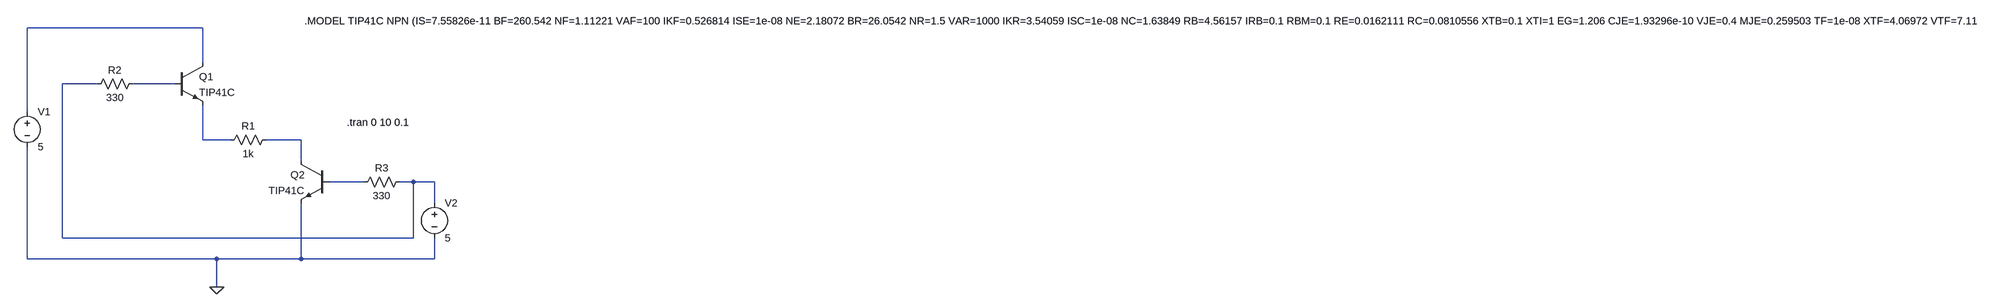
[diagram p0: schematic Draft14.asc]
Draft14.asc, the LTspice schematic file:
Version 4
SHEET 1 6028 688
WIRE 368 80 -32 80
WIRE 368 160 368 80
WIRE 128 208 48 208
WIRE 304 208 208 208
WIRE -32 272 -32 80
WIRE 368 336 368 256
WIRE 432 336 368 336
WIRE 592 336 512 336
WIRE 592 384 592 336
WIRE 736 432 656 432
WIRE 848 432 816 432
WIRE 896 432 848 432
WIRE 896 480 896 432
WIRE 48 560 48 208
WIRE 848 560 848 432
WIRE 848 560 48 560
WIRE -32 608 -32 352
WIRE 400 608 -32 608
WIRE 592 608 592 480
WIRE 592 608 400 608
WIRE 896 608 896 560
WIRE 896 608 592 608
WIRE 400 672 400 608
FLAG 400 672 0
SYMBOL npn 304 160 R0
SYMATTR InstName Q1
SYMATTR Value TIP41C
SYMBOL npn 656 384 M0
SYMATTR InstName Q2
SYMATTR Value TIP41C
SYMBOL res 528 320 R90
WINDOW 0 0 56 VBottom 2
WINDOW 3 32 56 VTop 2
SYMATTR InstName R1
SYMATTR Value 1k
SYMBOL res 224 192 R90
WINDOW 0 0 56 VBottom 2
WINDOW 3 32 56 VTop 2
SYMATTR InstName R2
SYMATTR Value 330
SYMBOL res 832 416 R90
WINDOW 0 0 56 VBottom 2
WINDOW 3 32 56 VTop 2
SYMATTR InstName R3
SYMATTR Value 330
SYMBOL voltage -32 256 R0
SYMATTR InstName V1
SYMATTR Value 5
SYMBOL voltage 896 464 R0
SYMATTR InstName V2
SYMATTR Value 5
TEXT 696 296 Left 2 !.tran 0 10 0.1
TEXT 600 64 Left 2 !.MODEL TIP41C NPN (IS=7.55826e-11 BF=260.542 NF=1.11221 VAF=100 IKF=0.526814 ISE=1e-08 NE=2.18072 BR=26.0542 NR=1.5 VAR=1000 IKR=3.54059 ISC=1e-08 NC=1.63849 RB=4.56157 IRB=0.1 RBM=0.1 RE=0.0162111 RC=0.0810556 XTB=0.1 XTI=1 EG=1.206 CJE=1.93296e-10 VJE=0.4 MJE=0.259503 TF=1e-08 XTF=4.06972 VTF=7.1157 ITF=0.001 CJC=1.09657e-10 VJC=0.730921 MJC=0.23 XCJC=0.803085 FC=0.8 TR=9.01013e-08 PTF=0 Vceo=100 ICrating=6 mfg=ON_Semi)

The netlist it stands for:
* Draft14.asc
Q1 N001 N003 N004 0 TIP41C
Q2 N005 N006 0 0 TIP41C
R1 N005 N004 1k
R2 N003 N002 330
R3 N002 N006 330
V1 N001 0 5
V2 N002 0 5
.model NPN NPN
.model PNP PNP
.lib standard.bjt
.tran 0 10 0.1
.MODEL TIP41C NPN (IS=7.55826e-11 BF=260.542 NF=1.11221 VAF=100 IKF=0.526814 ISE=1e-08 NE=2.18072 BR=26.0542 NR=1.5 VAR=1000 IKR=3.54059 ISC=1e-08 NC=1.63849 RB=4.56157 IRB=0.1 RBM=0.1 RE=0.0162111 RC=0.0810556 XTB=0.1 XTI=1 EG=1.206 CJE=1.93296e-10 VJE=0.4 MJE=0.259503 TF=1e-08 XTF=4.06972 VTF=7.1157 ITF=0.001 CJC=1.09657e-10 VJC=0.730921 MJC=0.23 XCJC=0.803085 FC=0.8 TR=9.01013e-08 PTF=0 Vceo=100 ICrating=6 mfg=ON_Semi)
.backanno
.end